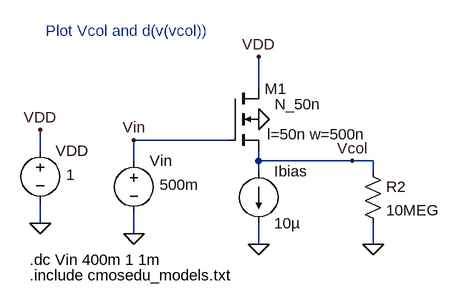
[diagram p0: schematic Fig17_31.asc]
Fig17_31.asc, the LTspice schematic file:
Version 4
SHEET 1 1556 680
WIRE 688 -240 688 -288
WIRE 640 -160 496 -160
WIRE 352 -144 352 -176
WIRE 496 -128 496 -160
WIRE 688 -128 688 -144
WIRE 832 -128 688 -128
WIRE 864 -128 832 -128
WIRE 688 -112 688 -128
WIRE 864 -112 864 -128
WIRE 352 -32 352 -64
WIRE 496 -16 496 -48
WIRE 688 0 688 -32
WIRE 864 0 864 -32
FLAG 352 -32 0
FLAG 352 -176 VDD
FLAG 496 -16 0
FLAG 496 -160 Vin
FLAG 688 -288 VDD
FLAG 688 0 0
FLAG 864 0 0
FLAG 688 -192 0
FLAG 832 -128 Vcol
SYMBOL voltage 352 -160 R0
WINDOW 123 0 0 Left 0
WINDOW 39 0 0 Left 0
WINDOW 3 40 53 Left 0
SYMATTR Value 1
SYMATTR InstName VDD
SYMBOL voltage 496 -144 R0
WINDOW 123 0 0 Left 0
WINDOW 39 0 0 Left 0
WINDOW 3 40 53 Left 0
SYMATTR Value 500m
SYMATTR InstName Vin
SYMBOL res 848 -128 R0
SYMATTR InstName R2
SYMATTR Value 10MEG
SYMBOL nmos4 640 -240 R0
WINDOW 0 57 1 Left 0
WINDOW 3 73 25 Left 0
WINDOW 123 61 71 Left 0
SYMATTR InstName M1
SYMATTR Value N_50n
SYMATTR Value2 l=50n w=500n
SYMBOL current 688 -112 R0
SYMATTR InstName Ibias
SYMATTR Value 10µ
TEXT 336 48 Left 0 !.include cmosedu_models.txt
TEXT 336 24 Left 0 !.dc Vin 400m 1 1m
TEXT 360 -328 Left 0 ;Plot Vcol and d(v(vcol))

The netlist it stands for:
* Fig17_31.asc
VDD VDD 0 1
Vin Vin 0 500m
R2 Vcol 0 10MEG
M1 VDD Vin Vcol 0 N_50n l=50n w=500n
Ibias Vcol 0 10µ
.model NMOS NMOS
.model PMOS PMOS
.lib standard.mos
.include cmosedu_models.txt
.dc Vin 400m 1 1m
* Plot Vcol and d(v(vcol))
.backanno
.end